# Altium schematic sheet Power.SchDoc: 5V os táp csatlakozó
size A4; Author: Király Krisztina; Organization: BME-AUT; DocumentNumber: 4; Revision: 17; SheetNumber: 4; SheetTotal: 4
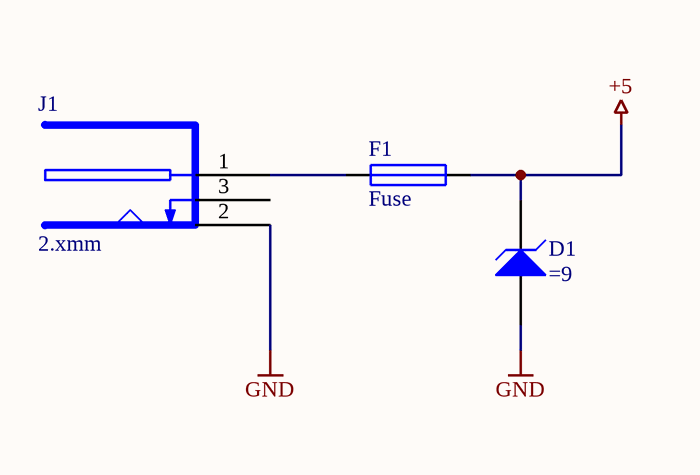
[diagram p0: Power.SchDoc]

## Parts
D1  (no value)  [FP_SMA]
F1  Fuse  [FP_MULTIFUSE]
J1  2.xmm  [FP_DC_TAP_ANYA]

## Nets
+5: D1.2(K) F1.2
GND: D1.1(A) J1.2(SLEEVE)
NetF1_1: F1.1 J1.1(PIN)

Not connected (* = marked no-connect by the designer): J1 3(BREAK)

## Notes on the sheet
- Title
- Size:
- Date:
- A4
- Number:
- Time:
- Revision:
- Sheet
- of
- File:

## Library data of the parts
D1 = ZENER: Zener Diode; U_Z: 24; Reference: 9550941; Name: VISHAY SMAJ5.0A-E3/61; Supplier: Farnell
F1 = Fuse: Name: 1.1A 33V 1812L110/33MR POLYFUSE SMD 1812 (LFS) ˝LF110-33˝; Reference: 44-03-25; Supplier: Lomex
J1 = DC_TAP_ANYA: 2.xmm DC HEBA25 TÁPFESZÜLTSÉG ALJZAT ZÁRT, NYÁKBA 90°; Name: TÁP DC ANYA 5.5/2.1/9.5mm DCS-5521-5; Supplier: Lomex; Reference: 43-07-67